# Altium schematic sheet Hoja_Micro.SchDoc: Hoja_Micro
size A4; SheetNumber: 3; SheetTotal: 6
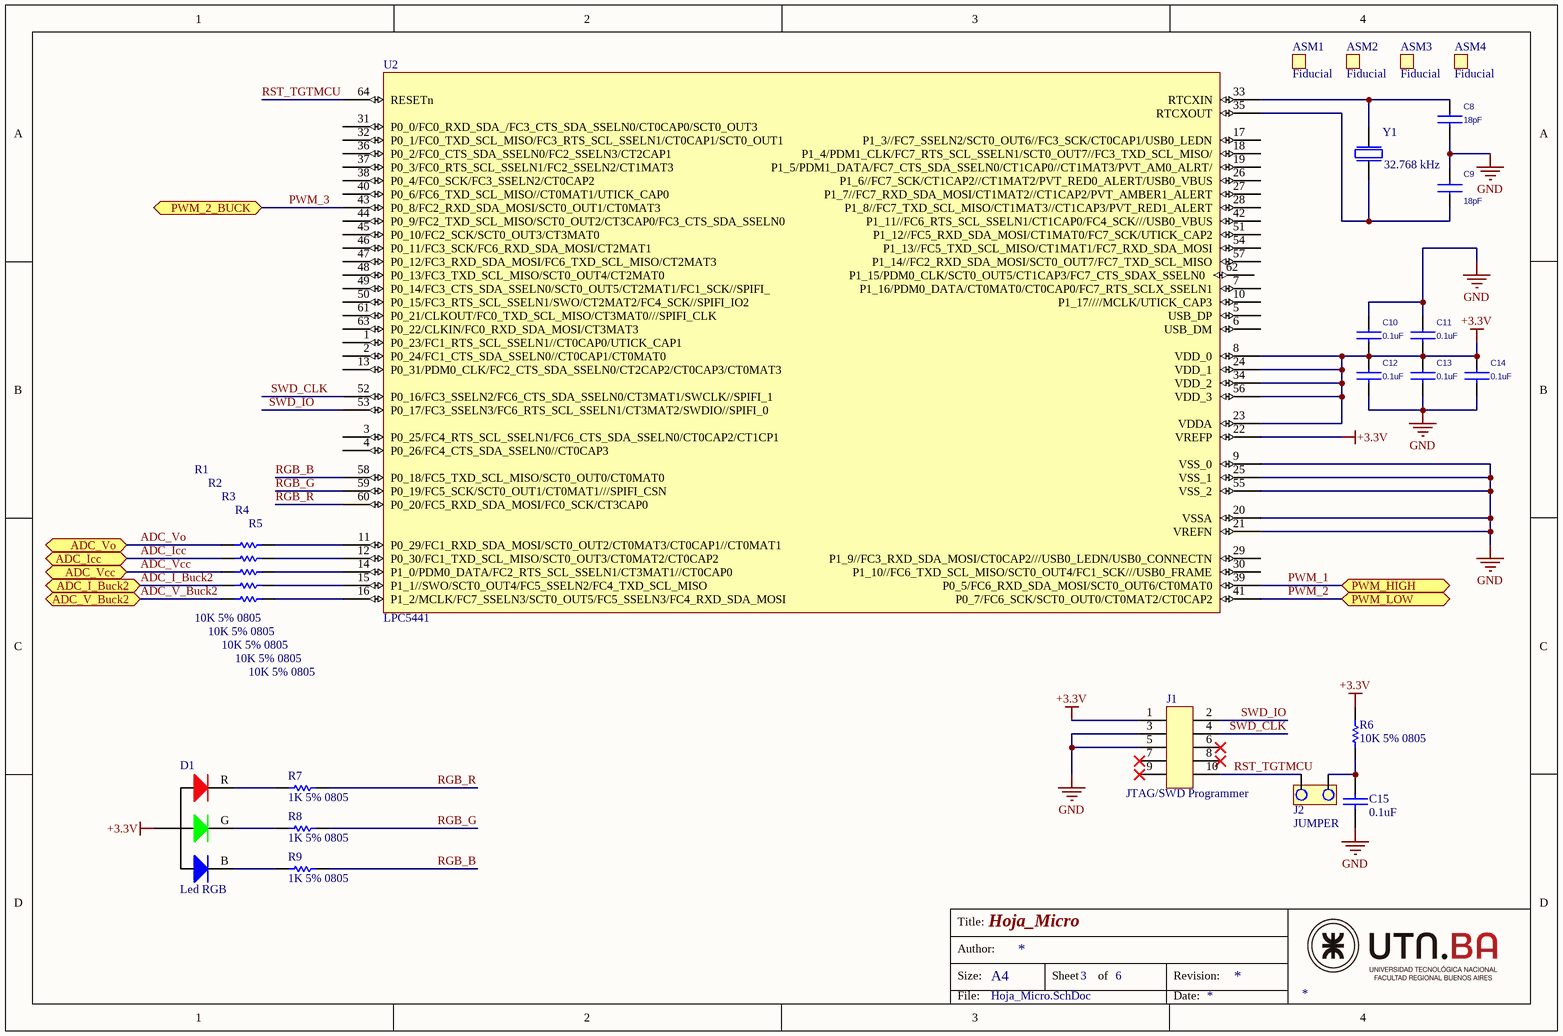
[diagram p0: Hoja_Micro.SchDoc]

## Parts
ASM1  Fiducial  [Fiducial]
ASM2  Fiducial  [Fiducial]
ASM3  Fiducial  [Fiducial]
ASM4  Fiducial  [Fiducial]
C8  18pF  [0805]
C9  18pF  [0805]
C10  0.1uF  [0805]
C11  0.1uF  [0805]
C12  0.1uF  [0805]
C13  0.1uF  [0805]
C14  0.1uF  [0805]
C15  0.1uF  [0805]
D1  Led RGB  [4-plcc]
J1  JTAG/SWD Programmer  [FTSH-105-01-XXX-DV-K]
J2  JUMPER  [JUMPER2]
R1  10K 5% 0805  [0805]
R2  10K 5% 0805  [0805]
R3  10K 5% 0805  [0805]
R4  10K 5% 0805  [0805]
R5  10K 5% 0805  [0805]
R6  10K 5% 0805  [0805]
R7  1K 5% 0805  [0805]
R8  1K 5% 0805  [0805]
R9  1K 5% 0805  [0805]
U2  LPC5441  [LQFP64]
Y1  32.768 kHz  [ABS07_Xtal]

## Ports
ADC_I_Buck2 (bidir), ADC_Icc (bidir), ADC_V_Buck2 (bidir), ADC_Vcc (bidir), ADC_Vo (bidir), PWM_2_BUCK (bidir), PWM_HIGH (bidir), PWM_LOW (bidir)

## Nets
+3.3V: C10.2 C11.2 C12.1 C13.1 C14.1 D1.A J1.1 R6.2 U2.8(VDD_0) U2.22(VREFP) U2.23(VDDA) U2.24(VDD_1) U2.34(VDD_2) U2.56(VDD_3)
GND: C8.2 C9.2 C10.1 C11.1 C12.2 C13.2 C14.2 C15.2 J1.3 J1.5 U2.9(VSS_0) U2.20(VSSA) U2.21(VREFN) U2.25(VSS_1) U2.55(VSS_2)
ADC_I_Buck2: R4.2 ; port ADC_I_Buck2
ADC_Icc: R2.2 ; port ADC_Icc
ADC_V_Buck2: R5.2 ; port ADC_V_Buck2
ADC_Vcc: R3.2 ; port ADC_Vcc
ADC_Vo: R1.2 ; port ADC_Vo
PWM_1: U2.39(P0_5/FC6_RXD_SDA_MOSI/SCT0_OUT6/CT0MAT0) ; port PWM_HIGH
PWM_2: U2.41(P0_7/FC6_SCK/SCT0_OUT0/CT0MAT2/CT0CAP2) ; port PWM_LOW
PWM_3: U2.43(P0_8/FC2_RXD_SDA_MOSI/SCT0_OUT1/CT0MAT3) ; port PWM_2_BUCK
RGB_B: R9.1 U2.58(P0_18/FC5_TXD_SCL_MISO/SCT0_OUT0/CT0MAT0)
RGB_G: R8.1 U2.59(P0_19/FC5_SCK/SCT0_OUT1/CT0MAT1///SPIFI_CSN)
RGB_R: R7.1 U2.60(P0_20/FC5_RXD_SDA_MOSI/FC0_SCK/CT3CAP0)
RST_TGTMCU: J1.10 J2.1 U2.64(RESETn)
SWD_CLK: J1.4 U2.52(P0_16/FC3_SSELN2/FC6_CTS_SDA_SSELN0/CT3MAT1/SWCLK//SPIFI_1)
SWD_IO: J1.2 U2.53(P0_17/FC3_SSELN3/FC6_RTS_SCL_SSELN1/CT3MAT2/SWDIO//SPIFI_0)
NetC8_1: C8.1 U2.33(RTCXIN) Y1.2
NetC9_1: C9.1 U2.35(RTCXOUT) Y1.1
NetC15_1: C15.1 J2.2 R6.1
NetD1_B: D1.B R9.2
NetD1_G: D1.G R8.2
NetD1_R: D1.R R7.2
NetR1_1: R1.1 U2.11(P0_29/FC1_RXD_SDA_MOSI/SCT0_OUT2/CT0MAT3/CT0CAP1//CT0MAT1)
NetR2_1: R2.1 U2.12(P0_30/FC1_TXD_SCL_MISO/SCT0_OUT3/CT0MAT2/CT0CAP2)
NetR3_1: R3.1 U2.14(P1_0/PDM0_DATA/FC2_RTS_SCL_SSELN1/CT3MAT1//CT0CAP0)
NetR4_1: R4.1 U2.15(P1_1//SWO/SCT0_OUT4/FC5_SSELN2/FC4_TXD_SCL_MISO)
NetR5_1: R5.1 U2.16(P1_2/MCLK/FC7_SSELN3/SCT0_OUT5/FC5_SSELN3/FC4_RXD_SDA_MOSI)

Not connected (* = marked no-connect by the designer): J1 6(43)* 7(39)* 8(42)* 9(40)*; U2 1(P0_23/FC1_RTS_SCL_SSELN1//CT0CAP0/UTICK_CAP1) 2(P0_24/FC1_CTS_SDA_SSELN0//CT0CAP1/CT0MAT0) 3(P0_25/FC4_RTS_SCL_SSELN1/FC6_CTS_SDA_SSELN0/CT0CAP2/CT1CP1) 4(P0_26/FC4_CTS_SDA_SSELN0//CT0CAP3) 5(USB_DP) 6(USB_DM) 7(P1_16/PDM0_DATA/CT0MAT0/CT0CAP0/FC7_RTS_SCLX_SSELN1) 10(P1_17////MCLK/UTICK_CAP3) 13(P0_31/PDM0_CLK/FC2_CTS_SDA_SSELN0/CT2CAP2/CT0CAP3/CT0MAT3) 17(P1_3//FC7_SSELN2/SCT0_OUT6//FC3_SCK/CT0CAP1/USB0_LEDN) 18(P1_4/PDM1_CLK/FC7_RTS_SCL_SSELN1/SCT0_OUT7//FC3_TXD_SCL_MISO/) 19(P1_5/PDM1_DATA/FC7_CTS_SDA_SSELN0/CT1CAP0//CT1MAT3/PVT_AM0_ALRT/) 26(P1_6//FC7_SCK/CT1CAP2//CT1MAT2/PVT_RED0_ALERT/USB0_VBUS) 27(P1_7//FC7_RXD_SDA_MOSI/CT1MAT2//CT1CAP2/PVT_AMBER1_ALERT) 28(P1_8//FC7_TXD_SCL_MISO/CT1MAT3//CT1CAP3/PVT_RED1_ALERT) 29(P1_9//FC3_RXD_SDA_MOSI/CT0CAP2///USB0_LEDN/USB0_CONNECTN) 30(P1_10//FC6_TXD_SCL_MISO/SCT0_OUT4/FC1_SCK///USB0_FRAME) 31(P0_0/FC0_RXD_SDA_/FC3_CTS_SDA_SSELN0/CT0CAP0/SCT0_OUT3) 32(P0_1/FC0_TXD_SCL_MISO/FC3_RTS_SCL_SSELN1/CT0CAP1/SCT0_OUT1) 36(P0_2/FC0_CTS_SDA_SSELN0/FC2_SSELN3/CT2CAP1) 37(P0_3/FC0_RTS_SCL_SSELN1/FC2_SSELN2/CT1MAT3) 38(P0_4/FC0_SCK/FC3_SSELN2/CT0CAP2) 40(P0_6/FC6_TXD_SCL_MISO//CT0MAT1/UTICK_CAP0) 42(P1_11//FC6_RTS_SCL_SSELN1/CT1CAP0/FC4_SCK///USB0_VBUS) 44(P0_9/FC2_TXD_SCL_MISO/SCT0_OUT2/CT3CAP0/FC3_CTS_SDA_SSELN0) 45(P0_10/FC2_SCK/SCT0_OUT3/CT3MAT0) 46(P0_11/FC3_SCK/FC6_RXD_SDA_MOSI/CT2MAT1) 47(P0_12/FC3_RXD_SDA_MOSI/FC6_TXD_SCL_MISO/CT2MAT3) 48(P0_13/FC3_TXD_SCL_MISO/SCT0_OUT4/CT2MAT0) 49(P0_14/FC3_CTS_SDA_SSELN0/SCT0_OUT5/CT2MAT1/FC1_SCK//SPIFI_) 50(P0_15/FC3_RTS_SCL_SSELN1/SWO/CT2MAT2/FC4_SCK//SPIFI_IO2) 51(P1_12//FC5_RXD_SDA_MOSI/CT1MAT0/FC7_SCK/UTICK_CAP2) 54(P1_13//FC5_TXD_SCL_MISO/CT1MAT1/FC7_RXD_SDA_MOSI) 57(P1_14//FC2_RXD_SDA_MOSI/SCT0_OUT7/FC7_TXD_SCL_MISO) 61(P0_21/CLKOUT/FC0_TXD_SCL_MISO/CT3MAT0///SPIFI_CLK) 62(P1_15/PDM0_CLK/SCT0_OUT5/CT1CAP3/FC7_CTS_SDAX_SSELN0) 63(P0_22/CLKIN/FC0_RXD_SDA_MOSI/CT3MAT3)

## Notes on the sheet
- Title:
- Size:
- Author:
- A4
- Sheet
- of
- Revision:
- File:
- Date:

## Library data of the parts
ASM1-ASM4 = Fiducial: Fiducial Mark for PCB Asembly on Pick N' Place
C8 C9 = CAPACITOR NON-POL: CAP CER 0.1UF X7R 0805
C10-C14 = CAP NP: CAP CER 0.1UF X7R 0805
C15 = CAP: CAP CER 0.1UF X7R 0805
D1 = LED_RGB: CREE LED P/N: CLV1L-FKB-CHMMQEHBB7673673CT-ND / CREE LED P/N: CLMVC-FKA-CL1D1L71BB7C3C3CT-ND
J1 = JTAG: CONN HEADER 10POS DUAL .05" SMD -> FTSH-105-01-F-DV-K
R1-R5 R7-R9 = RES
R6 = RES: RES SMD 10K OHM 5% 1/8W 0805
Y1 = XTAL ABS07: XTAL ABS07 by ABRACON LLC